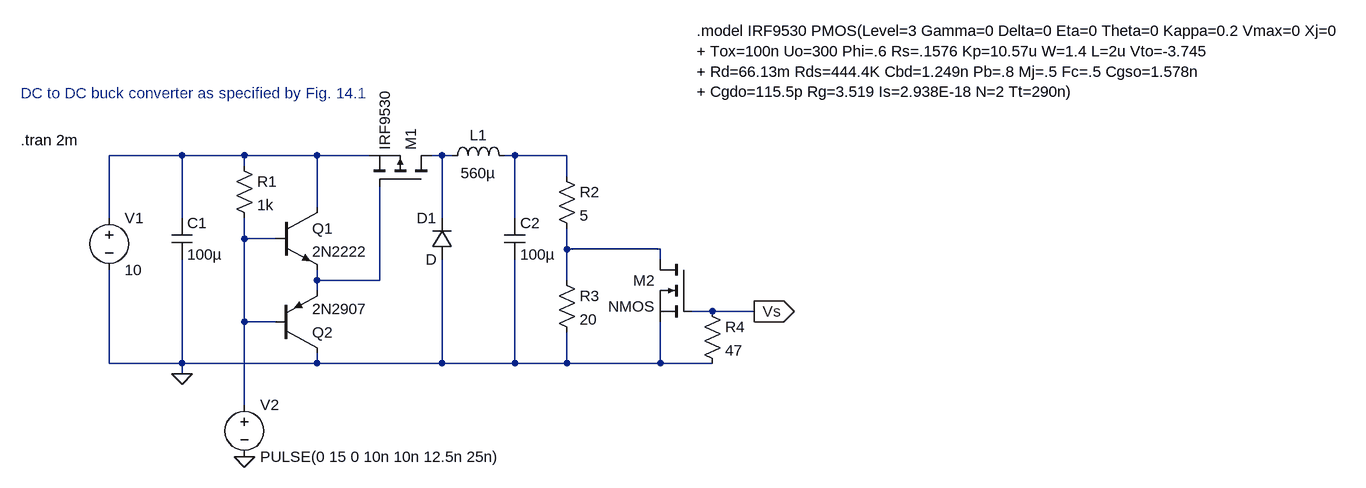
[diagram p0: schematic dc2dcbuck.asc]
dc2dcbuck.asc, the LTspice schematic file:
Version 4
SHEET 1 1892 680
WIRE 16 128 -96 128
WIRE 112 128 16 128
WIRE 224 128 112 128
WIRE 304 128 224 128
WIRE 416 128 400 128
WIRE 432 128 416 128
WIRE 528 128 512 128
WIRE 608 128 528 128
WIRE 112 144 112 128
WIRE 608 160 608 128
WIRE 224 208 224 128
WIRE -96 224 -96 128
WIRE 16 224 16 128
WIRE 416 224 416 128
WIRE 528 224 528 128
WIRE 112 256 112 224
WIRE 160 256 112 256
WIRE 608 272 608 240
WIRE 752 272 608 272
WIRE 752 288 752 272
WIRE 224 320 224 304
WIRE 320 320 320 176
WIRE 320 320 224 320
WIRE 608 320 608 272
WIRE 224 336 224 320
WIRE 832 368 800 368
WIRE 896 368 832 368
WIRE 112 384 112 256
WIRE 160 384 112 384
WIRE -96 448 -96 304
WIRE 16 448 16 288
WIRE 16 448 -96 448
WIRE 224 448 224 432
WIRE 224 448 16 448
WIRE 416 448 416 288
WIRE 416 448 224 448
WIRE 528 448 528 288
WIRE 528 448 416 448
WIRE 608 448 608 400
WIRE 608 448 528 448
WIRE 752 448 752 384
WIRE 752 448 608 448
WIRE 832 448 752 448
WIRE 16 464 16 448
WIRE 112 512 112 384
FLAG 16 464 0
FLAG 896 368 Vs
IOPIN 896 368 Out
FLAG 112 592 0
SYMBOL voltage -96 208 R0
WINDOW 123 0 0 Left 0
WINDOW 39 0 0 Left 0
SYMATTR InstName V1
SYMATTR Value 10
SYMBOL cap 0 224 R0
SYMATTR InstName C1
SYMATTR Value 100µ
SYMBOL res 96 128 R0
SYMATTR InstName R1
SYMATTR Value 1k
SYMBOL npn 160 208 R0
SYMATTR InstName Q1
SYMATTR Value 2N2222
SYMBOL pnp 160 432 M180
SYMATTR InstName Q2
SYMATTR Value 2N2907
SYMBOL pmos 400 176 M270
SYMATTR InstName M1
SYMATTR Value IRF9530
SYMBOL ind 416 144 R270
WINDOW 0 32 56 VTop 2
WINDOW 3 5 56 VBottom 2
SYMATTR InstName L1
SYMATTR Value 560µ
SYMBOL cap 512 224 R0
SYMATTR InstName C2
SYMATTR Value 100µ
SYMBOL diode 432 288 R180
WINDOW 0 24 64 Left 2
WINDOW 3 24 0 Left 2
SYMATTR InstName D1
SYMBOL res 592 144 R0
SYMATTR InstName R2
SYMATTR Value 5
SYMBOL res 592 304 R0
SYMATTR InstName R3
SYMATTR Value 20
SYMBOL nmos 800 288 M0
SYMATTR InstName M2
SYMBOL res 816 352 R0
SYMATTR InstName R4
SYMATTR Value 47
SYMBOL voltage 112 496 R0
WINDOW 123 0 0 Left 0
WINDOW 39 0 0 Left 0
SYMATTR InstName V2
SYMATTR Value PULSE(0 15 0 10n 10n 12.5n 25n)
TEXT -232 32 Left 2 ;DC to DC buck converter as specified by Fig. 14.1
TEXT 808 -64 Left 2 !.model IRF9530 PMOS(Level=3 Gamma=0 Delta=0 Eta=0 Theta=0 Kappa=0.2 Vmax=0 Xj=0\n+ Tox=100n Uo=300 Phi=.6 Rs=.1576 Kp=10.57u W=1.4 L=2u Vto=-3.745\n+ Rd=66.13m Rds=444.4K Cbd=1.249n Pb=.8 Mj=.5 Fc=.5 Cgso=1.578n\n+ Cgdo=115.5p Rg=3.519 Is=2.938E-18 N=2 Tt=290n)
TEXT -232 104 Left 2 !.tran 2m

The netlist it stands for:
* dc2dcbuck.asc
V1 N001 0 10
C1 N001 0 100µ
R1 N001 N004 1k
Q1 N001 N004 N006 0 2N2222
Q2 0 N004 N006 0 2N2907
M1 N002 N006 N001 N001 IRF9530
L1 N002 N003 560µ
C2 N003 0 100µ
D1 0 N002 D
R2 N003 N005 5
R3 N005 0 20
M2 N005 Vs 0 0 NMOS
R4 Vs 0 47
V2 N004 0 PULSE(0 15 0 10n 10n 12.5n 25n)
.model D D
.lib standard.dio
.model NPN NPN
.model PNP PNP
.lib standard.bjt
.model NMOS NMOS
.model PMOS PMOS
.lib standard.mos
* DC to DC buck converter as specified by Fig. 14.1
.model IRF9530 PMOS(Level=3 Gamma=0 Delta=0 Eta=0 Theta=0 Kappa=0.2 Vmax=0 Xj=0
+ Tox=100n Uo=300 Phi=.6 Rs=.1576 Kp=10.57u W=1.4 L=2u Vto=-3.745
+ Rd=66.13m Rds=444.4K Cbd=1.249n Pb=.8 Mj=.5 Fc=.5 Cgso=1.578n
+ Cgdo=115.5p Rg=3.519 Is=2.938E-18 N=2 Tt=290n)
.tran 2m
.backanno
.end